# EAGLE design crown-layout (EAGLE 6.4)
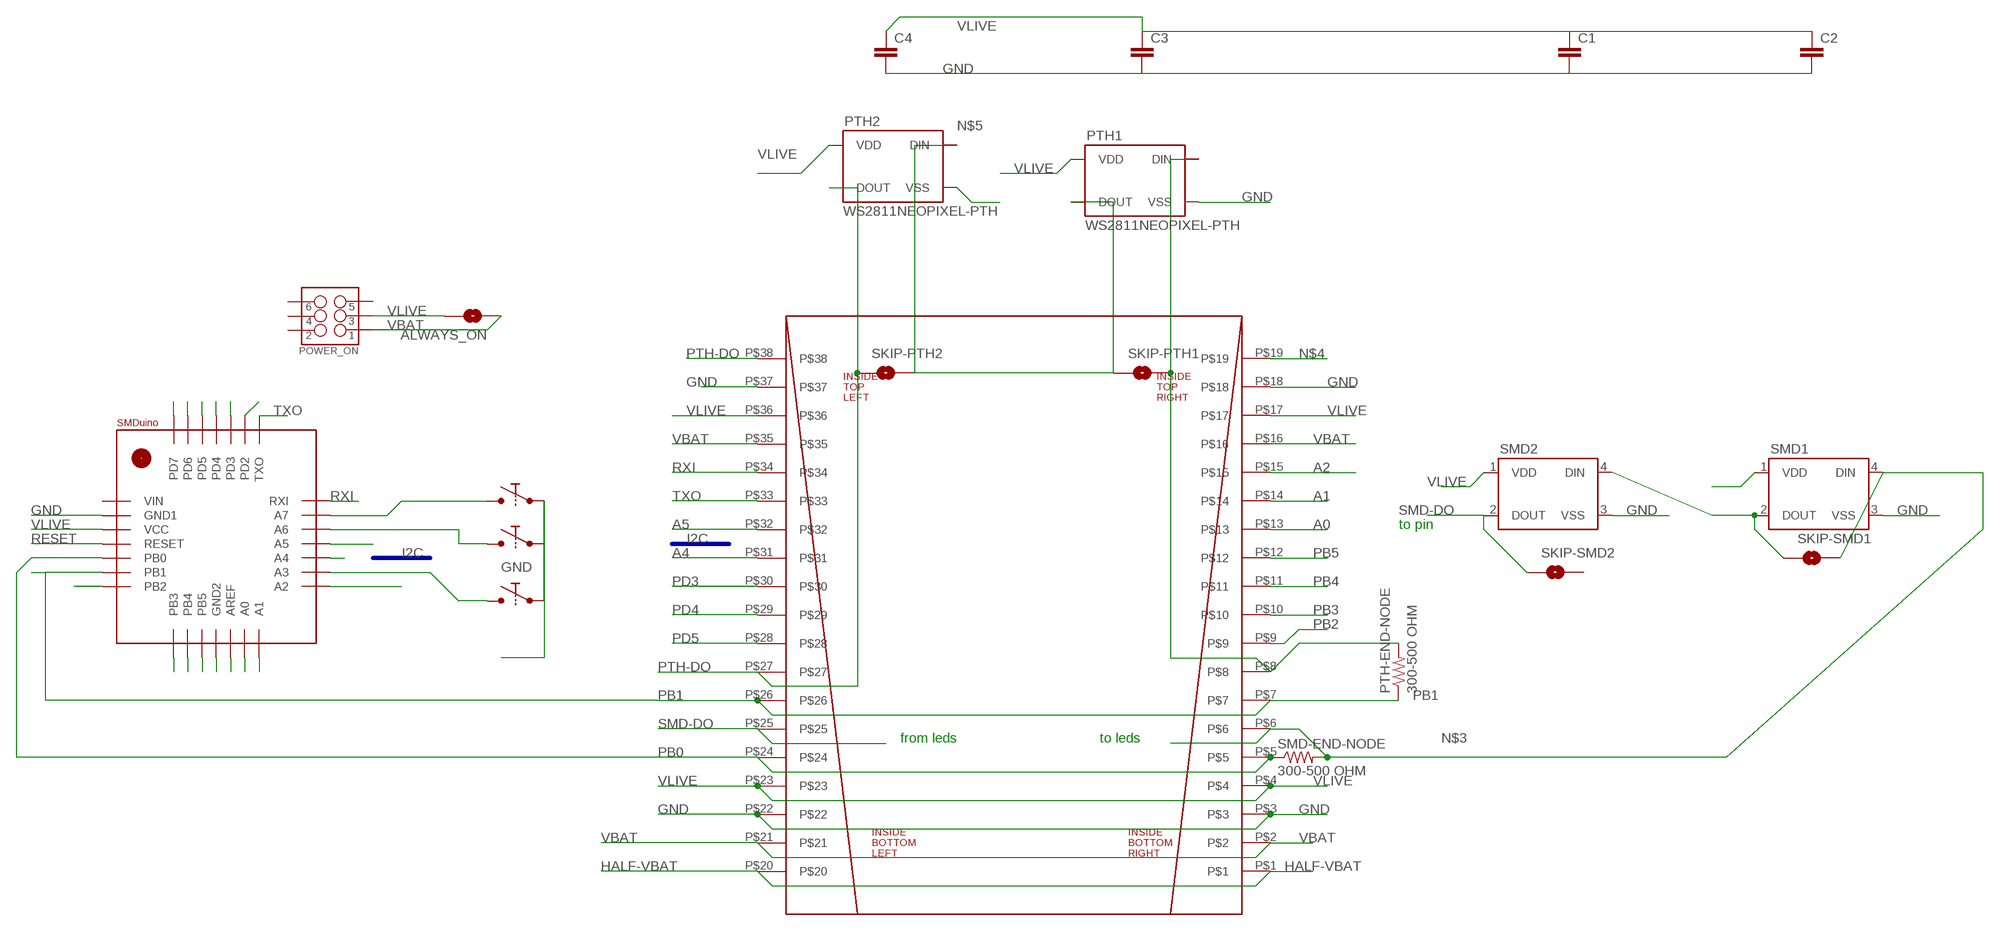
[diagram p0: schematic, sheet 1]

## Parts
A6  BUTTONSMD_BUTTON  [SMD_BUTTON]
A7  BUTTONSMD_BUTTON  [SMD_BUTTON]
ALWAYS_ON  SOLDERJUMPERNC2  [SJ_2S-NOTRACE]
C1  CAP0805  [0805]
C2  CAP0805  [0805]
C3  CAP0805  [0805]
C4  CAP0805  [0805]
D2  BUTTONSMD_BUTTON  [SMD_BUTTON]
POWER_ON  M03X2FEMALE_SMD  [2X3_SMD]
PTH1  WS2811NEOPIXEL-PTH  [WS2811-PTH-FLAT]
PTH2  WS2811NEOPIXEL-PTH  [WS2811-PTH-FLAT]
PTH-END-NODE  300-500 OHM  RESISTOR0805-RES  [0805]
SKIP-PTH1  SOLDERJUMPERNC2  [SJ_2S-NOTRACE]
SKIP-PTH2  SOLDERJUMPERNC2  [SJ_2S-NOTRACE]
SKIP-SMD1  SOLDERJUMPERNC2  [SJ_2S-NOTRACE]
SKIP-SMD2  SOLDERJUMPERNC2  [SJ_2S-NOTRACE]
SMD1  WS2812B  [WS2812B]
SMD2  WS2812B  [WS2812B]
SMD-END-NODE  300-500 OHM  RESISTOR0805-RES  [0805]
U$1  SMDUINO  [SMDUINO]
U$2  CROWNSTANDARD  [CROWN]

## Nets
A0: U$1.A0 U$2.P$13
A1: U$1.A1 U$2.P$14
A2: U$1.A2 U$2.P$15
A3: A6.P$1 A6.P$2 U$1.A3
A4: U$1.A4 U$2.P$31
A5: U$1.A5 U$2.P$32
A6: A7.P$1 A7.P$2 U$1.A6
A7: D2.P$1 D2.P$2 U$1.A7
GND: A6.P$3 A6.P$4 A7.P$3 A7.P$4 C1.2 C2.2 C3.2 C4.2 D2.P$3 D2.P$4 PTH1.P$2(VSS) PTH1.P$6(VSS) PTH2.P$2(VSS) PTH2.P$6(VSS) SMD1.3(VSS) SMD2.3(VSS) U$1.GND1 U$2.P$3 U$2.P$18 U$2.P$22 U$2.P$37
HALF-VBAT: U$2.P$1 U$2.P$20
N$2: U$1.PB5
N$3: SKIP-SMD1.2 SMD1.4(DIN) SMD-END-NODE.2 U$2.P$6
N$4: PTH1.P$4(DIN) PTH1.P$8(DIN) PTH-END-NODE.2 SKIP-PTH1.2 U$2.P$8 U$2.P$19
N$5: PTH1.P$1(DOUT) PTH1.P$5(DOUT) PTH2.P$4(DIN) PTH2.P$8(DIN) SKIP-PTH1.1 SKIP-PTH2.2
N$7: U$1.GND2
N$10: SKIP-SMD1.1 SMD1.2(DOUT) SMD2.4(DIN)
N$24: U$1.AREF
PB0: SMD-END-NODE.1 U$1.PB0 U$2.P$5 U$2.P$24
PB1: PTH-END-NODE.1 U$1.PB1 U$2.P$7 U$2.P$26
PB2: U$1.PB2 U$2.P$9
PB3: U$1.PB3 U$2.P$10
PB4: U$1.PB4 U$2.P$11
PB5: U$2.P$12
PD2: U$1.PD2
PD3: U$1.PD3 U$2.P$30
PD4: U$1.PD4 U$2.P$29
PD5: U$1.PD5 U$2.P$28
PD6: U$1.PD6
PD7: U$1.PD7
PTH-DO: PTH2.P$1(DOUT) PTH2.P$5(DOUT) SKIP-PTH2.1 U$2.P$27 U$2.P$38
RESET: U$1.RESET
RXI: U$1.RXI U$2.P$34
SMD-DO: SKIP-SMD2.1 SMD2.2(DOUT) U$2.P$25
TXO: U$1.TXO U$2.P$33
VBAT: ALWAYS_ON.1 POWER_ON.1 U$2.P$2 U$2.P$16 U$2.P$21 U$2.P$35
VLIVE: ALWAYS_ON.2 C1.1 C2.1 C3.1 C4.1 POWER_ON.3 PTH1.P$3(VDD) PTH1.P$7(VDD) PTH2.P$3(VDD) PTH2.P$7(VDD) SMD1.1(VDD) SMD2.1(VDD) U$1.VCC U$2.P$4 U$2.P$17 U$2.P$23 U$2.P$36
Unconnected: POWER_ON.2 POWER_ON.4 POWER_ON.5 POWER_ON.6 SKIP-SMD2.2 U$1.VIN

## Buses
I2C

## Notes on the sheet
- to pin
- from leds | to leds

## Library data of the parts
A6 A7 D2 = tekdemo:BUTTON
ALWAYS_ON SKIP-PTH1 SKIP-PTH2 SKIP-SMD1 SKIP-SMD2 = SparkFun-Passives:SOLDERJUMPER: Solder Jumper Standard SMD solder jumper. Used to automate production. Two varients : Normally Open and Normally Closed are the same, but have different paste layers. NC will have a large amount of paste and should jumper during reflow.
C1-C4 = SparkFun-Passives:CAP: Capacitor Standard 0603 ceramic capacitor, and 0.1" leaded capacitor.
POWER_ON = SparkFun-Connectors:M03X2: 2x3 .1" header. Shrouded, with keying- CONN-10681 SMT- CONN-11415 Pogo pins- HW-11044; PROD_ID: CONN-11290
PTH1 PTH2 = tekdemo:WS2811
PTH-END-NODE SMD-END-NODE = SparkFun-Passives:RESISTOR: Resistor Basic schematic elements and footprints for 0603, 1206, and PTH resistors.
SMD1 SMD2 = SparkFun-LED:WS2812B: WS2812B - Intelligent control LED integrated light source Technical Specifications: Power Supply Voltage (VDD): 3.5 to 5.3 V Input Voltage (VI): -0.5 to VDD+0.5 V Operating Junction Temperature (Topt): -25°C to +80°C Storage Temperature Range (Tstg): -55°C to +150°C
U$1 = SMDuino:SMDUINO
U$2 = pcb_crown:CROWN

## Board
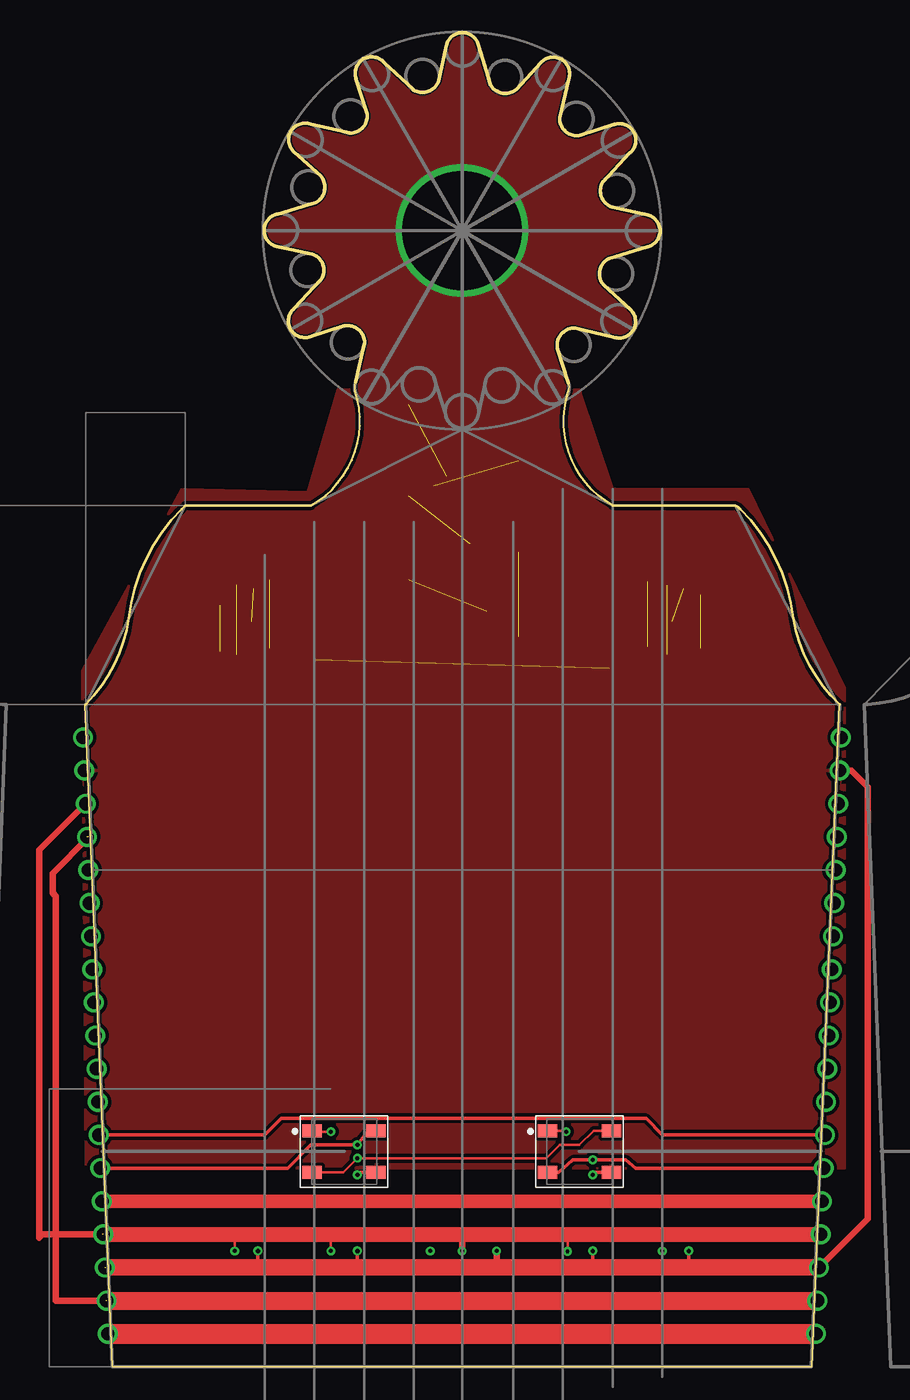
[diagram p1: board, top side]
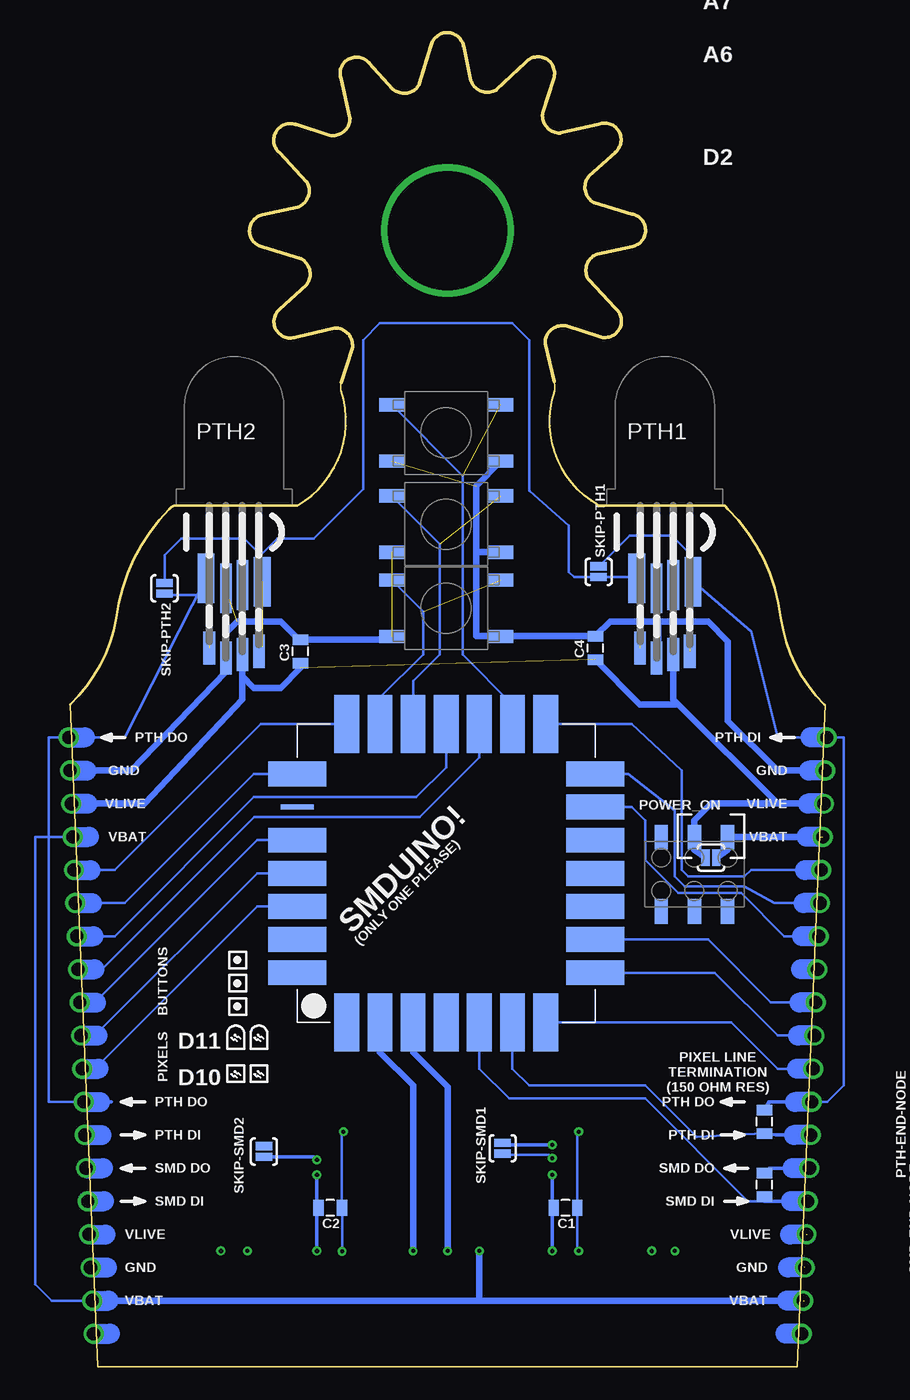
[diagram p2: board, bottom side, seen from below]

Size 57.86 x 102.3 mm. Coordinates in mm from the lower left corner, seen from the top.
Outline: 0.08,50.8 arc37 3.38,57.4 arc-38 7.44,65.79 7.7,66.04 17.35,66.04 arc79 20.73,74.83 arc-35 20.78,75.51
Outline: 57.86,50.8 arc-37 54.31,57.4 arc38 50.24,65.79 arc23 49.86,66.04 40.46,66.04 arc-79 37.08,74.83 arc32 37.08,75.46
Outline: 30.2,101.24 arc160 27.71,101.27 arc-160 30.2,101.24
Outline: 33.12,97.97 arc-100 31.09,98.32 arc100 33.12,97.97
Outline: 14.81,88.39 17.68,89.28
Outline: 18.09,91.31 16.05,93.14 18.09,91.31
Outline: 14.81,88.39 arc160 14.78,85.9 arc-160 14.81,88.39
Outline: 17.73,89.28 arc100 18.09,91.31
Outline: 20.27,94.62 17.34,95.28 arc160 16.07,93.14
Outline: 21.63,96.17 20.79,98.77 21.63,96.17
Outline: 20.31,94.59 arc100 21.63,96.17
Outline: 25.17,97.95 22.97,99.99 arc160 20.8,98.77
Outline: 27.71,101.28 27.14,98.61 arc-100 25.2,97.9
Outline: 43.05,85.85 arc160 43.08,88.34 arc-160 43.05,85.85
Outline: 30.2,101.24 31.09,98.37
Outline: 33.12,97.97 34.95,100 33.12,97.97
Outline: 36.43,95.79 37.09,98.72 arc160 34.95,99.98
Outline: 37.98,94.42 40.58,95.27 37.98,94.42
Outline: 36.4,95.74 arc100 37.98,94.42
Outline: 39.76,90.88 41.8,93.08 arc160 40.57,95.25
Outline: 43.09,88.35 40.42,88.92 arc-100 39.71,90.85
Outline: 20.77,75.53 21.44,78.46
Outline: 19.88,79.83 17.28,78.98 19.88,79.83
Outline: 21.46,78.5 arc100 19.88,79.83
Outline: 18.11,83.37 16.07,81.16 arc160 17.29,78.99
Outline: 14.77,85.9 17.44,85.33 arc-100 18.15,83.39
Outline: 43.05,85.85 40.18,84.96
Outline: 39.78,82.93 41.81,81.1 39.78,82.93
Outline: 40.13,84.96 arc100 39.78,82.93
Outline: 37.6,79.63 40.53,78.96 arc160 41.79,81.1
Outline: 36.23,78.07 37.07,75.47 36.23,78.07
Outline: 37.55,79.65 arc100 36.23,78.07
Copper layers (1*16): Top 0.0356mm / dielectric 1.5011mm / Bottom 0.0356mm
Design rules "LaenPCBOrder *": minimum track width 6mil, minimum drill 13mil, track to track 6mil, track to pad 6mil, pad to pad 6mil, via to via 6mil, smd to smd 6mil, copper to edge 5mil, drill to drill 6mil, minimum pad ring 7mil, minimum via ring 7mil, stop-mask expansion 4mil, vias tented up to drill 25mil, thermal gap 10mil

### Footprints (pad centres in the part's own frame; a part is rotated, then mirrored left to right if it is on the bottom)
SMD_BUTTON = smd 1.905 x 1.016: P$1 -1.016,5.334; P$2 7.366,5.334; P$3 -1.016,1.016; P$4 7.366,1.016
SJ_2S-NOTRACE = smd 0.635 x 1.27: 1 -0.401,0; 2 0.413,0
0805 = smd 0.8 x 1.2: 1 -0.9,0; 2 0.9,0
2X3_SMD = smd 1.02 x 1.9: 1 -2.54,-2.85; 2 -2.54,2.85; 3 0,-2.85; 4 0,2.85; 5 2.54,-2.85; 6 2.54,2.85
WS2811-PTH-FLAT = smd 1.27 x 3.81: P$1 -2.159,-5.588; P$4 2.159,-5.842 | smd 0.889 x 3.81: P$2 -0.635,-6.35; P$3 0.635,-6.096 | smd 0.889 x 2.54: P$5 -1.905,-10.922; P$6 -0.635,-11.684; P$7 0.635,-11.43; P$8 1.905,-11.176
WS2812B = smd 1.5 x 1: 1 -2.45,1.6; 2 -2.45,-1.6; 3 2.45,-1.6; 4 2.45,1.6
SMDUINO = smd 1.905 x 4.445: A0 16.51,0; A1 19.05,0; AREF 13.97,0; GND2 11.43,0; PB3 3.81,0; PB4 6.35,0; PB5 8.89,0; PD3 13.97,22.86; PD4 11.43,22.86; PD5 8.89,22.86; PD6 6.35,22.86; PD7 3.81,22.86; TXO 19.05,22.86 | smd 4.445 x 1.905: A2 22.86,3.81; A3 22.86,6.35; A4 22.86,8.89; A5 22.86,11.43; A6 22.86,13.97; A7 22.86,16.51; GND1 0,16.51; PB0 0,8.89; PB1 0,6.35; PB2 0,3.81; RESET 0,11.43; RXI 22.86,19.05; VCC 0,13.97; VIN 0,19.05 | smd 0.381 x 2.54: PD2 16.51,22.86
CROWN = drill 1.016: P$1 -0.33,2.54; P$2 -0.432,5.08; P$3 -0.559,7.62; P$4 -0.686,10.16; P$5 -0.787,12.7; P$6 -0.914,15.24; P$7 -1.016,17.78; P$8 -1.092,20.32; P$9 -1.194,22.86; P$10 -1.295,25.4; P$11 -1.397,27.94; P$12 -1.524,30.48; P$13 -1.626,33.02; P$14 -1.727,35.56; P$15 -1.829,38.1; P$16 -1.93,40.64; P$17 -2.032,43.18; P$18 -2.134,45.72; P$19 -2.235,48.26; P$20 53.95,2.54; P$21 54.051,5.08; P$22 54.178,7.62; P$23 54.305,10.16; P$24 54.407,12.7; P$25 54.534,15.24; P$26 54.635,17.78; P$27 54.712,20.32; P$28 54.813,22.86; P$29 54.915,25.4; P$30 55.016,27.94; P$31 55.143,30.48; P$32 55.245,33.02; P$33 55.347,35.56; P$34 55.448,38.1; P$35 55.55,40.64; P$36 55.651,43.18; P$37 55.753,45.72; P$38 55.855,48.26

### Placement (x,y rotation side)
A6  32.21,68.43 0 bottom
A7  32.21,61.44 0 bottom
ALWAYS_ON  8.74,39.04 180 bottom
C1  19.89,12.19 180 bottom
C2  37.92,12.19 180 bottom
C3  40.21,54.86 90 bottom
C4  17.6,55.12 90 bottom
D2  32.21,54.99 0 bottom
POWER_ON  10.01,37.77 180 bottom
PTH1  12.27,66.04 0 bottom
PTH2  45.29,66.04 0 bottom
PTH-END-NODE  4.65,18.8 90 bottom
SKIP-PTH1  17.35,60.96 90 bottom
SKIP-PTH2  50.62,59.69 90 bottom
SKIP-SMD1  24.71,16.76 90 bottom
SKIP-SMD2  43,16.51 90 bottom
SMD1  19.89,16.51 0 top
SMD2  37.92,16.51 0 top
SMD-END-NODE  4.65,13.97 90 bottom
U$1  17.6,26.42 90 bottom
U$2  2.11,0 0 top

### Tracks (layer width: path | path; a pad name or v marks a point on that pad's centre or on a via)
A0
  Bottom 0.203: U$1.A0 14.81,42.93 13.79,41.91 13.79,38.86 11.25,36.32 6.43,36.32 3.12,33.02 1.75,33.02
A1
  Bottom 0.203: U$1.A1 15.06,45.47 11.51,42.67 11.51,37.59 10.74,36.83 6.17,36.83 3.89,35.56 U$2.P$14
A2
  Bottom 0.203: U$1.A2 14.81,49.28 11,45.72 11,38.1 10.49,37.59 6.17,37.59 5.66,38.1 U$2.P$15
A3  (1 unrouted)
  Bottom 0.203: U$1.A3 23.95,50.8 27.76,54.61 27.76,68.3 A6.P$1
A4
  Bottom 0.203: U$1.A4 26.49,46.74 31.06,42.16 43.74,42.16 55.42,30.48 U$2.P$31 56.97,30.48
A5
  Bottom 0.203: U$1.A5 29.03,45.97 31.32,43.69 43.76,43.69 54.43,33.02 U$2.P$32
A6  (1 unrouted)
  Bottom 0.203: U$1.A6 31.57,52.58 29.54,54.61 29.54,63.09 A7.P$1
A7  (1 unrouted)
  Bottom 0.203: U$1.A7 34.11,51.31 30.81,54.61 30.81,57.91 D2.P$1
GND  (via drill 0.3, 0.33)  (5 unrouted)
  Top 0.254: SMD1.3 21.08,14.91 v20.9,14.73 | SMD2.3 39.12,14.91 v38.94,14.73 | v46.3,8.89 46.3,7.62 | v38.94,8.89 38.94,7.62 | v20.9,8.89 20.9,7.62 | v13.28,8.89 13.28,7.62
  Top 0.508: v31.57,8.89 31.57,7.62 | U$2.P$37 58.75,45.72 60.02,44.45 60.02,11.35 U$2.P$22
  Top 1.27: 1.6,7.62 13.28,7.62 20.9,7.62 31.57,7.62 38.94,7.62 46.3,7.62 U$2.P$22
  Bottom 0.203: 12.78,54.36 PTH1.P$6 | C4.2 17.86,56.02 | U$1.GND1 34.11,24.13
  Bottom 0.254: v20.9,14.73 20.9,12.19 | 20.9,12.19 v20.9,8.89 | C1.2 20.9,12.19 | v38.94,14.73 38.94,12.19 | 38.94,12.19 v38.94,8.89 | C2.2 38.94,12.19
  Bottom 0.508: U$2.P$37 53.16,45.72 45.92,53.26 PTH2.P$6 45.92,56.26 45.03,57.15 41.73,57.15 40.35,55.76 C3.2 33.47,55.76 D2.P$3 | C4.2 16.47,57.15 12.78,57.15 | 12.78,57.15 8.97,57.15 7.44,55.63 7.44,49.53 3.63,45.72 U$2.P$18 | PTH1.P$6 12.78,54.48 12.78,57.15 | 34.11,24.13 31.57,21.59 v31.57,8.89 | 24.83,56.02 17.86,56.02 | 24.83,56.02 D2.P$4 | 24.83,56.02 26.75,56.02 26.75,62.48 | 26.75,62.48 26.75,67.54 A6.P$4 | A7.P$4 26.72,62.46 26.75,62.48
  pour Top (isolate 0.254): 0.08,15.24 -0.18,53.34 7.44,67.31 17.09,67.06 19.38,74.93 37.92,74.93 40.46,67.31 50.88,67.31 58.24,52.07 58.24,15.24
HALF-VBAT
  Top 1.524: U$2.P$1 U$2.P$20
N$2
  Bottom 0.203: 15.57,35.31 U$1.PB5
N$3  (via drill 0.33)
  Top 0.254: U$2.P$6 15.57,15.24 17.35,17.02 v20.9,17.02 21.74,18.11 SMD1.4
  Bottom 0.254: U$2.P$6 4.28,15.24 SMD-END-NODE.2 | SKIP-SMD1.2 24.56,17.02 v20.9,17.02
N$4  (1 unrouted)
  Bottom 0.203: 10.36,58.42 10.36,59.94 10.24,60.07 | 10.24,60.07 PTH1.P$4 5.66,56.39 3.63,48.26 U$2.P$19 -1.45,48.26 -1.45,21.59 -0.18,20.32 2.36,20.32 | 10.24,60.07 10.24,62.23 11.76,63.75 14.97,63.75 SKIP-PTH1.2
  Bottom 0.254: 4.28,20.32 4.3,20.32 | PTH1.P$4 9.98,60.45 | PTH1.P$8 10.24,54.86 | U$2.P$8 2.36,20.32 4.28,20.32 | 4.28,20.32 PTH-END-NODE.2
N$5  (2 unrouted)
  Bottom 0.203: 43.13,55.24 43.26,55.12 | 14.55,60.71 14.17,60.33 14.17,62.1 | SKIP-PTH2.2 50.62,62.23 49.35,63.5 44.53,63.5 43.26,62.23 | 43.26,62.23 43.26,60.33 PTH2.P$4 | 43.26,62.23 41.99,63.5 39.19,63.5 35.38,67.31 35.38,78.74 34.11,80.01 23.95,80.01 22.68,78.74 22.68,67.18 22.63,67.16 19.63,64.52 19.63,60.96 19.23,60.56 SKIP-PTH1.1 14.53,60.56 PTH1.P$1
  Bottom 0.254: PTH2.P$8 43.26,55.12 | 14.55,60.71 PTH1.P$1
N$10  (via drill 0.3)
  Top 0.203: SMD1.2 19.81,14.91 v20.9,16 35.38,16 36.4,17.02 37.92,17.02 39.01,18.11 SMD2.4
  Bottom 0.203: SKIP-SMD1.1 24.61,16.26 21.16,16.26 v20.9,16
PB0
  Top 0.254: 17.44,12.79 17.35,12.7
  Top 1.016: U$2.P$5 17.35,12.7 U$2.P$24
  Bottom 0.127: 4.65,12.7 SMD-END-NODE.1
  Bottom 0.203: 5.16,12.7 4.65,12.7 | 1.6,12.7 5.92,12.7 13.79,20.57 24.21,20.57 26.49,22.86 U$1.PB0
  Bottom 0.254: U$2.P$5 1.6,12.7 4.65,12.7
PB1
  Top 0.254: U$2.P$26 44.27,17.78 43.03,19.05 15.06,19.05 13.79,17.78 U$2.P$7
  Bottom 0.203: 4.76,17.78 PTH-END-NODE.1 9.84,17.64 13.79,21.59 22.68,21.59 23.95,22.86 U$1.PB1
  Bottom 0.254: 3.77,17.78 3.78,17.78 | U$2.P$7 3.77,17.78 | 3.77,17.78 PTH-END-NODE.1
PB2
  Bottom 0.203: U$1.PB2 7.19,26.42 3.63,22.86 U$2.P$9
PB3
  Bottom 0.203: U$1.PB3 8.46,30.23 3.63,25.4 U$2.P$10
PB4
  Bottom 0.203: U$1.PB4 8.97,32.77 4.14,27.94 U$2.P$11
PD3
  Bottom 0.203: U$1.PD3 43.51,40.39 55.96,27.94 U$2.P$30
PD4
  Bottom 0.203: U$1.PD4 43.51,37.85 55.96,25.4 U$2.P$29
PD5
  Bottom 0.203: U$1.PD5 43.51,35.31 55.96,22.86 U$2.P$28
PTH-DO  (1 unrouted)
  Bottom 0.203: SKIP-PTH2.1 50.01,59.18 47.19,59.18 | U$2.P$27 59.51,20.32 59.51,48.26 56.72,48.26 53.67,48.26 PTH2.P$1
  Bottom 0.254: U$2.P$27 54.69,20.32 | 47.19,54.74 PTH2.P$5 | 47.19,59.18 47.19,59.54 PTH2.P$1
RXI
  Bottom 0.203: U$1.RXI 43.26,49.28 54.43,38.1 U$2.P$34
SMD-DO  (via drill 0.33)
  Top 0.254: U$2.P$25 42.24,15.24 41.48,15.88 v38.94,15.88 37.41,15.88 36.32,14.91 SMD2.2 35.64,14.91
  Bottom 0.254: SKIP-SMD2.1 39.17,16.11 v38.94,15.88
TOPCOPPER  (via drill 9.14)
  other vias: 28.93,87.12
  pour Top: 13.69,87.12 arc-90 28.93,102.36 29.18,102.36 arc-90 44.17,87.38 44.17,87.12 arc-90 28.93,71.88 arc-90
TXO
  Bottom 0.203: U$1.TXO 43.76,45.47 53.67,35.56 U$2.P$33
VBAT  (via drill 0.3)  (2 unrouted)
  Top 0.508: 0.33,40.64 -2.46,37.85 -2.46,36.32 -2.21,36.07 -2.21,5.08 1.6,5.08
  Top 1.397: U$2.P$2 U$2.P$21
  Bottom 0.203: U$2.P$21 59.26,5.08 60.53,6.35 60.53,40.64 U$2.P$35
  Bottom 0.508: 26.49,5.08 U$2.P$2 | v26.49,8.89 26.49,5.08 | 26.49,5.08 U$2.P$21 56.21,5.08 | U$2.P$16 POWER_ON.1 7.47,39.66 ALWAYS_ON.1
VLIVE  (via drill 0.3)  (4 unrouted)
  Top 0.203: v11.51,8.89 11.51,10.16 | v18.87,8.89 18.87,10.16 | SMD1.1 17.44,18.03 v18.87,18.03 | SMD2.1 36.65,18.11 v36.91,18.03 | v37.01,8.87 37.01,10.16 | v44.27,8.89 44.27,10.16
  Top 0.508: v28.93,8.89 28.93,10.16 | U$2.P$17 -3.48,39.62 -3.48,9.91 -3.23,10.16 1.35,10.16
  Top 1.143: U$2.P$4 11.51,10.16 18.87,10.16 28.93,10.16 37.01,10.16 44.27,10.16 U$2.P$23
  Bottom 0.203: v18.87,8.89 18.99,8.89 C1.1 18.99,17.92 arc90 v18.87,18.03 | v36.91,18.03 37.02,18.03 C2.1 | C2.1 37.16,12.19 | C2.1 37.01,12.19 v37.01,8.87 | U$1.VCC 31.45,26.42 31.45,24
  Bottom 0.508: U$2.P$36 52.15,43.18 44.65,51.18 PTH2.P$7 44.65,52.96 43.76,52.07 41.73,52.07 40.21,53.59 C3.1 | U$2.P$17 3.63,43.18 | 3.63,43.18 11.25,50.8 | 11.25,50.8 14.18,50.8 C4.1 | 11.25,50.8 11.63,51.18 PTH1.P$7 | 3.63,43.18 8.71,43.18 10.01,41.88 POWER_ON.3 10.01,39.64 ALWAYS_ON.2 | 31.57,24.13 31.45,24 28.93,21.49 v28.93,8.89

### Text on the board
bPlace: PTH DI | PTH DO | GND | GND | VLIVE | VLIVE | VBAT | VBAT | BUTTONS | D11 | D10 | PIXELS | PIXEL LINE / TERMINATION / (150 OHM RES) | PTH DO | PTH DO | PTH DI | PTH DI | SMD DO | SMD DO | SMD DI | SMD DI | VLIVE | VLIVE | GND | GND | VBAT | VBAT
bNames: (ONLY ONE PLEASE) | SMDUINO!